# Altium schematic sheet MOTORES.SchDoc
size A4
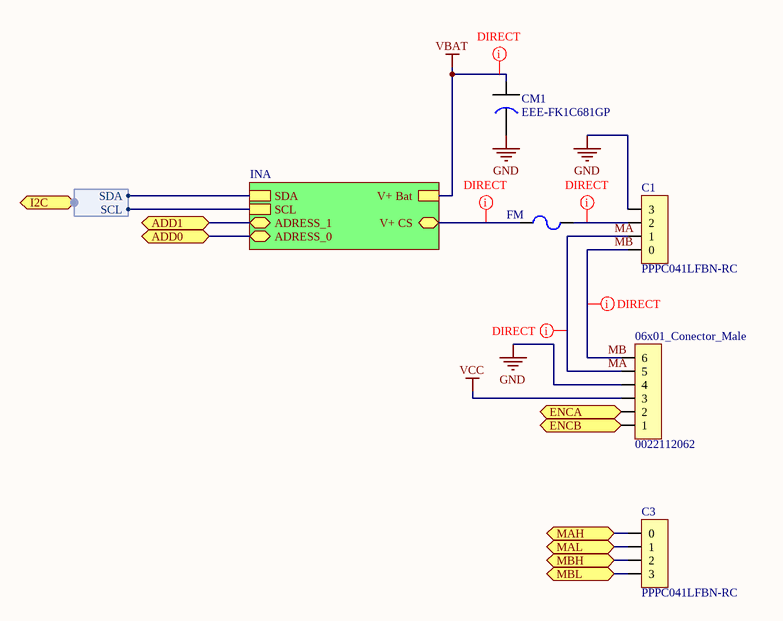
[diagram p0: MOTORES.SchDoc]

## Parts
06x01_Conector_Male  0022112062  [06x01_Conector_Male]
C1  PPPC041LFBN-RC  [04x01_Conector_Female]
C3  PPPC041LFBN-RC  [04x01_Conector_Female]
CM1  EEE-FK1C681GP  [EEE-FK1C681GP]
FM  MF-MSMF250/16X  [RESC4632X16N]  (value not drawn)

## Sub-sheets
INA = INA220.SchDoc: V+ Bat, SDA, SCL, ADRESS_1, ADRESS_0, V+ CS

## Ports
ADD0, ADD1, ENCA, ENCB, I2C (harness I2C), MAH, MAL, MBH, MBL

## Harnesses
I2C: SDA, SCL

## Nets
GND: 06x01_Conector_Male.4 C1.3 CM1.2
VBAT: CM1.1 ; sheet INA/V+ Bat
VCC: 06x01_Conector_Male.3
ADD0: port ADD0, sheet INA/ADRESS_0
ADD1: port ADD1, sheet INA/ADRESS_1
ENCA: 06x01_Conector_Male.2 ; port ENCA
ENCB: 06x01_Conector_Male.1 ; port ENCB
MA: 06x01_Conector_Male.5 C1.1
MAH: C3.0 ; port MAH
MAL: C3.1 ; port MAL
MB: 06x01_Conector_Male.6 C1.0
MBH: C3.2 ; port MBH
MBL: C3.3 ; port MBL
NetC1_2: C1.2 FM.1
NetFM_2: FM.2 ; sheet INA/V+ CS
(unnamed): sheet INA/SDA, port I2C.SDA
(unnamed): sheet INA/SCL, port I2C.SCL

## Layout directives
net class DIRECT: MA, MB, NetC1_2, NetFM_2, VBAT

## Library data of the parts
06x01_Conector_Male = 06x01_Conector_Male: CONN HEADER 6POS .100 VERT GOLD
C1 C3 = 04x01_Conector_Female-SCH: 4 Position Header Connector 0.100" (2.54mm) Through Hole Gold
CM1 = CAP AL 680UF/16V: Aluminum Electrolytic Capacitors - SMD Al Lytic Cap SMT FK Series 105C
FM = MF-MSMF250/16X-01.A.1: PTC RESETTABLE .30A 30V 1812